# Altium schematic sheet Overview.SchDoc
size A4; DocumentNumber: 1; SheetNumber: 0; SheetTotal: 7; PostalCode_City: PostalCode_City; Country: Country; Company: Robert BOSCH GmbH; TelefonNumber: TelefonNumber; Street: Street; Department: Department
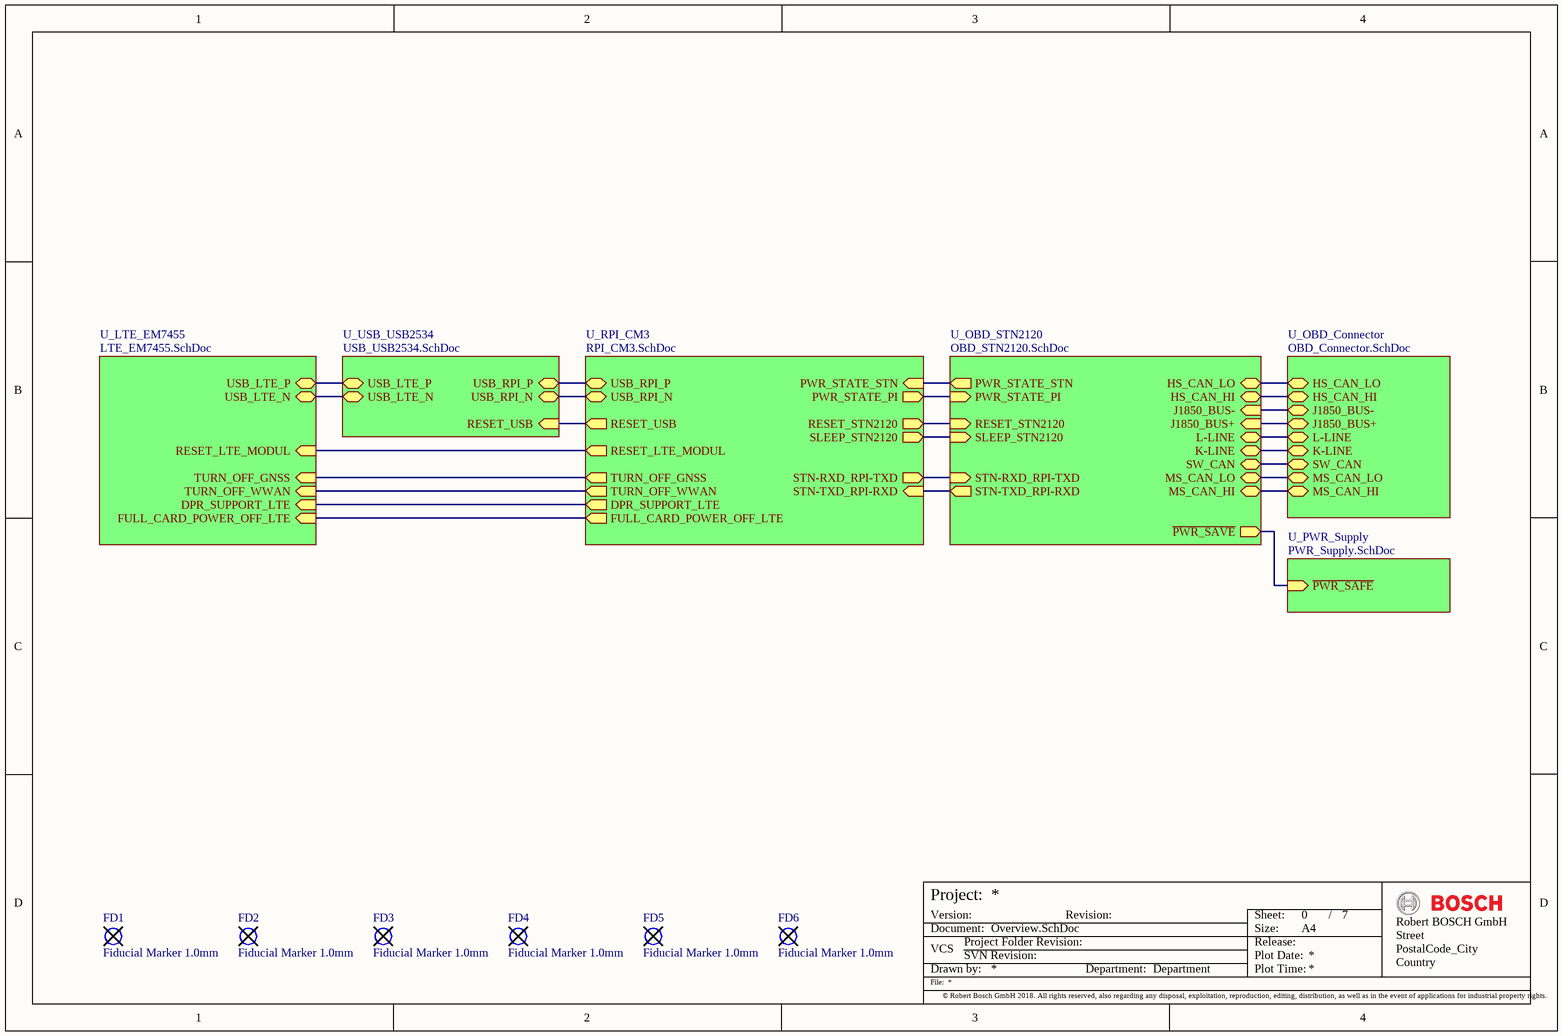
[diagram p0: Overview.SchDoc]

## Parts
FD1  Fiducial Marker 1.0mm  [Fiducial Marker]
FD2  Fiducial Marker 1.0mm  [Fiducial Marker]
FD3  Fiducial Marker 1.0mm  [Fiducial Marker]
FD4  Fiducial Marker 1.0mm  [Fiducial Marker]
FD5  Fiducial Marker 1.0mm  [Fiducial Marker]
FD6  Fiducial Marker 1.0mm  [Fiducial Marker]

## Sub-sheets
U_LTE_EM7455 = LTE_EM7455.SchDoc: RESET_LTE_MODUL (in), TURN_OFF_GNSS (in), TURN_OFF_WWAN (in), FULL_CARD_POWER_OFF_LTE (in), DPR_SUPPORT_LTE (in), USB_LTE_P (bidir), USB_LTE_N (bidir)
U_OBD_Connector = OBD_Connector.SchDoc: MS_CAN_HI (bidir), MS_CAN_LO (bidir), SW_CAN (bidir), K-LINE (bidir), L-LINE (bidir), J1850_BUS+ (bidir), J1850_BUS- (bidir), HS_CAN_HI (bidir), HS_CAN_LO (bidir)
U_OBD_STN2120 = OBD_STN2120.SchDoc: SW_CAN (bidir), MS_CAN_HI (bidir), MS_CAN_LO (bidir), HS_CAN_HI (bidir), HS_CAN_LO (bidir), RESET_STN2120 (in), J1850_BUS+ (in), J1850_BUS- (in), K-LINE (bidir), L-LINE (bidir), PWR_STATE_PI (in), PWR_STATE_STN (out), SLEEP_STN2120 (in), STN-RXD_RPI-TXD (in), STN-TXD_RPI-RXD (out), ~{PWR_SAVE} (out)
U_PWR_Supply = PWR_Supply.SchDoc: ~{PWR_SAFE} (in)
U_RPI_CM3 = RPI_CM3.SchDoc: FULL_CARD_POWER_OFF_LTE (out), TURN_OFF_WWAN (out), TURN_OFF_GNSS (out), RESET_LTE_MODUL (out), RESET_USB (out), RESET_STN2120 (out), PWR_STATE_PI (out), PWR_STATE_STN (in), USB_RPI_N (bidir), USB_RPI_P (bidir), DPR_SUPPORT_LTE (out), SLEEP_STN2120 (out), STN-RXD_RPI-TXD (out), STN-TXD_RPI-RXD (in)
U_USB_USB2534 = USB_USB2534.SchDoc: RESET_USB (in), USB_RPI_N (bidir), USB_RPI_P (bidir), USB_LTE_N (bidir), USB_LTE_P (bidir)

## Nets
(unnamed): sheet U_LTE_EM7455/RESET_LTE_MODUL, sheet U_RPI_CM3/RESET_LTE_MODUL
(unnamed): sheet U_LTE_EM7455/TURN_OFF_GNSS, sheet U_RPI_CM3/TURN_OFF_GNSS
(unnamed): sheet U_LTE_EM7455/TURN_OFF_WWAN, sheet U_RPI_CM3/TURN_OFF_WWAN
(unnamed): sheet U_LTE_EM7455/FULL_CARD_POWER_OFF_LTE, sheet U_RPI_CM3/FULL_CARD_POWER_OFF_LTE
(unnamed): sheet U_LTE_EM7455/DPR_SUPPORT_LTE, sheet U_RPI_CM3/DPR_SUPPORT_LTE
(unnamed): sheet U_LTE_EM7455/USB_LTE_P, sheet U_USB_USB2534/USB_LTE_P
(unnamed): sheet U_LTE_EM7455/USB_LTE_N, sheet U_USB_USB2534/USB_LTE_N
(unnamed): sheet U_OBD_Connector/MS_CAN_HI, sheet U_OBD_STN2120/MS_CAN_HI
(unnamed): sheet U_OBD_Connector/MS_CAN_LO, sheet U_OBD_STN2120/MS_CAN_LO
(unnamed): sheet U_OBD_Connector/SW_CAN, sheet U_OBD_STN2120/SW_CAN
(unnamed): sheet U_OBD_Connector/K-LINE, sheet U_OBD_STN2120/K-LINE
(unnamed): sheet U_OBD_Connector/L-LINE, sheet U_OBD_STN2120/L-LINE
(unnamed): sheet U_OBD_Connector/J1850_BUS+, sheet U_OBD_STN2120/J1850_BUS+
(unnamed): sheet U_OBD_Connector/J1850_BUS-, sheet U_OBD_STN2120/J1850_BUS-
(unnamed): sheet U_OBD_Connector/HS_CAN_HI, sheet U_OBD_STN2120/HS_CAN_HI
(unnamed): sheet U_OBD_Connector/HS_CAN_LO, sheet U_OBD_STN2120/HS_CAN_LO
(unnamed): sheet U_RPI_CM3/RESET_USB, sheet U_USB_USB2534/RESET_USB
(unnamed): sheet U_RPI_CM3/RESET_STN2120, sheet U_OBD_STN2120/RESET_STN2120
(unnamed): sheet U_RPI_CM3/PWR_STATE_PI, sheet U_OBD_STN2120/PWR_STATE_PI
(unnamed): sheet U_RPI_CM3/PWR_STATE_STN, sheet U_OBD_STN2120/PWR_STATE_STN
(unnamed): sheet U_RPI_CM3/USB_RPI_N, sheet U_USB_USB2534/USB_RPI_N
(unnamed): sheet U_RPI_CM3/USB_RPI_P, sheet U_USB_USB2534/USB_RPI_P
(unnamed): sheet U_RPI_CM3/SLEEP_STN2120, sheet U_OBD_STN2120/SLEEP_STN2120
(unnamed): sheet U_RPI_CM3/STN-RXD_RPI-TXD, sheet U_OBD_STN2120/STN-RXD_RPI-TXD
(unnamed): sheet U_RPI_CM3/STN-TXD_RPI-RXD, sheet U_OBD_STN2120/STN-TXD_RPI-RXD
(unnamed): sheet U_PWR_Supply/~{PWR_SAFE}, sheet U_OBD_STN2120/~{PWR_SAVE}

Not connected (* = marked no-connect by the designer): FD1 1; FD2 1; FD3 1; FD4 1; FD5 1; FD6 1

## Notes on the sheet
- Project:
- Version:
- Revision:
- Sheet:
- /
- Document:
- File:
- Drawn by:
- VCS
- Project Folder Revision:
- SVN Revision:
- Department:
- Plot Date:
- Size:
- Plot Time:
- Release:
- A4
- © Robert Bosch GmbH 2018. All rights reserved, also regarding any disposal, exploitation, reproduction, editing, distribution, as well as in the event of applications for industrial property rights.

## Library data of the parts
FD1-FD6 = CMP-00184-7: Passermarke / Fiducial Marker / Kammera-Marke 1.0mm Durchmesser , 500µm Lackfreistellung; Assembly: no; Case: 1.0mm